# Altium project A8_v1.0.PrjPcb
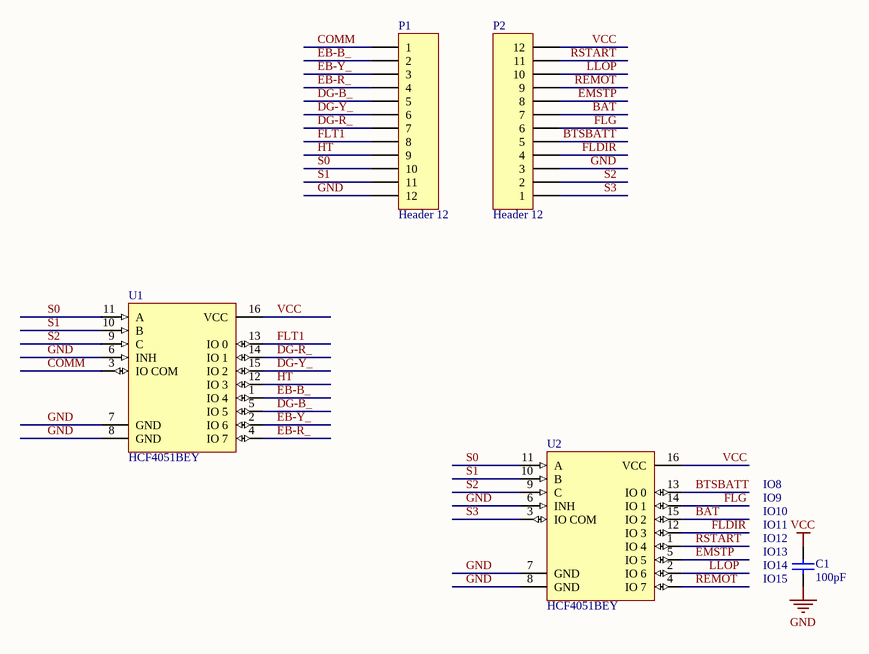
[diagram p0: 4067_to_4051.SchDoc]
1 sheet, 5 parts. Net scope: global (net labels, ports and power ports of the same name join across sheets).
Board files: A8_multiple.PcbDoc, A8_v1.0.PcbDoc

## Sheet 4067_to_4051.SchDoc
size A4; Author: Suraj; DrawnBy: Suraj; Engineer: Suraj; Organization: Simcons Control Systems; Address1: Kalamassery; Address2: Cochin; Address4: India

### Parts
C1  value 100pF  [C1206_W]  (hidden comment: .1uF 1206)
P1  Header 12  [HDR1X12]
P2  Header 12  [HDR1X12]
U1  HCF4051BEY  [DIP16]
U2  HCF4051BEY  [DIP16]

### Nets
GND: C1.1 P1.12 P2.3 U1.6(INH) U1.7(GND) U1.8(GND) U2.6(INH) U2.7(GND) U2.8(GND)
VCC: C1.2 P2.12 U1.16(VCC) U2.16(VCC)
BAT: P2.7 U2.15(IO_2)
BTSBATT: P2.5 U2.13(IO_0)
COMM: P1.1 U1.3(IO_COM)
DG-B_: P1.5 U1.5(IO_5)
DG-R_: P1.7 U1.14(IO_1)
DG-Y_: P1.6 U1.15(IO_2)
EB-B_: P1.2 U1.1(IO_4)
EB-R_: P1.4 U1.4(IO_7)
EB-Y_: P1.3 U1.2(IO_6)
EMSTP: P2.8 U2.5(IO_5)
FLDIR: P2.4 U2.12(IO_3)
FLG: P2.6 U2.14(IO_1)
FLT1: P1.8 U1.13(IO_0)
HT: P1.9 U1.12(IO_3)
LLOP: P2.10 U2.2(IO_6)
REMOT: P2.9 U2.4(IO_7)
RSTART: P2.11 U2.1(IO_4)
S0: P1.10 U1.11(A) U2.11(A)
S1: P1.11 U1.10(B) U2.10(B)
S2: P2.2 U1.9(C) U2.9(C)
S3: P2.1 U2.3(IO_COM)

### Notes on the sheet
- IO8
- IO9
- (near C1) IO10
- (near C1) IO11
- (near C1) IO12
- (near C1) IO13
- (near C1) IO14
- (near C1) IO15
- Title
- Size:
- A4
- Number:
- Revision:
- Simcons Control Systems
- Kalamassery
- Cochin
- India
- Date:
- Drawn By:
- SURAJ K A
- Sheet
- of

### Library data of the parts
C1 = Cap: Capacitor; Published: 8-Jun-2000; LatestRevisionDate: 17-Jul-2002; LatestRevisionNote: Re-released for DXP Platform.; PackageReference: RAD-0.3; Publisher: Altium Limited; PackageDescription: Radial Cap, Thru-Hole; 2 Leads; 0.3 in Pin Spacing
P1 P2 = Header 12: Header, 12-Pin; LatestRevisionDate: 17-Jul-2002; LatestRevisionNote: Re-released for DXP Platform.; Publisher: Altium Limited
U1 U2 = HCF4051BEY: Analog Multiplexer/Demultiplexer; Published: 8-Jun-2000; LatestRevisionDate: 06-Jun-2005; LatestRevisionNote: Stylized 3D Model Added.; DatasheetVersion: Jun-1989; PackageVersion: Apr-1996; PackageReference: DIP16; Publisher: Altium Limited; PackageDescription: DIP; 16 Leads; Row Spacing 7.62 mm; Pitch 2.54 mm; ComponentLink1Description: Manufacturer Link; ComponentLink1URL: http://www.st.com/; ComponentLink2Description: Datasheet; ComponentLink2URL: http://www.st.com/stonline/products/literature/ds/2053/hcf4051.pdf